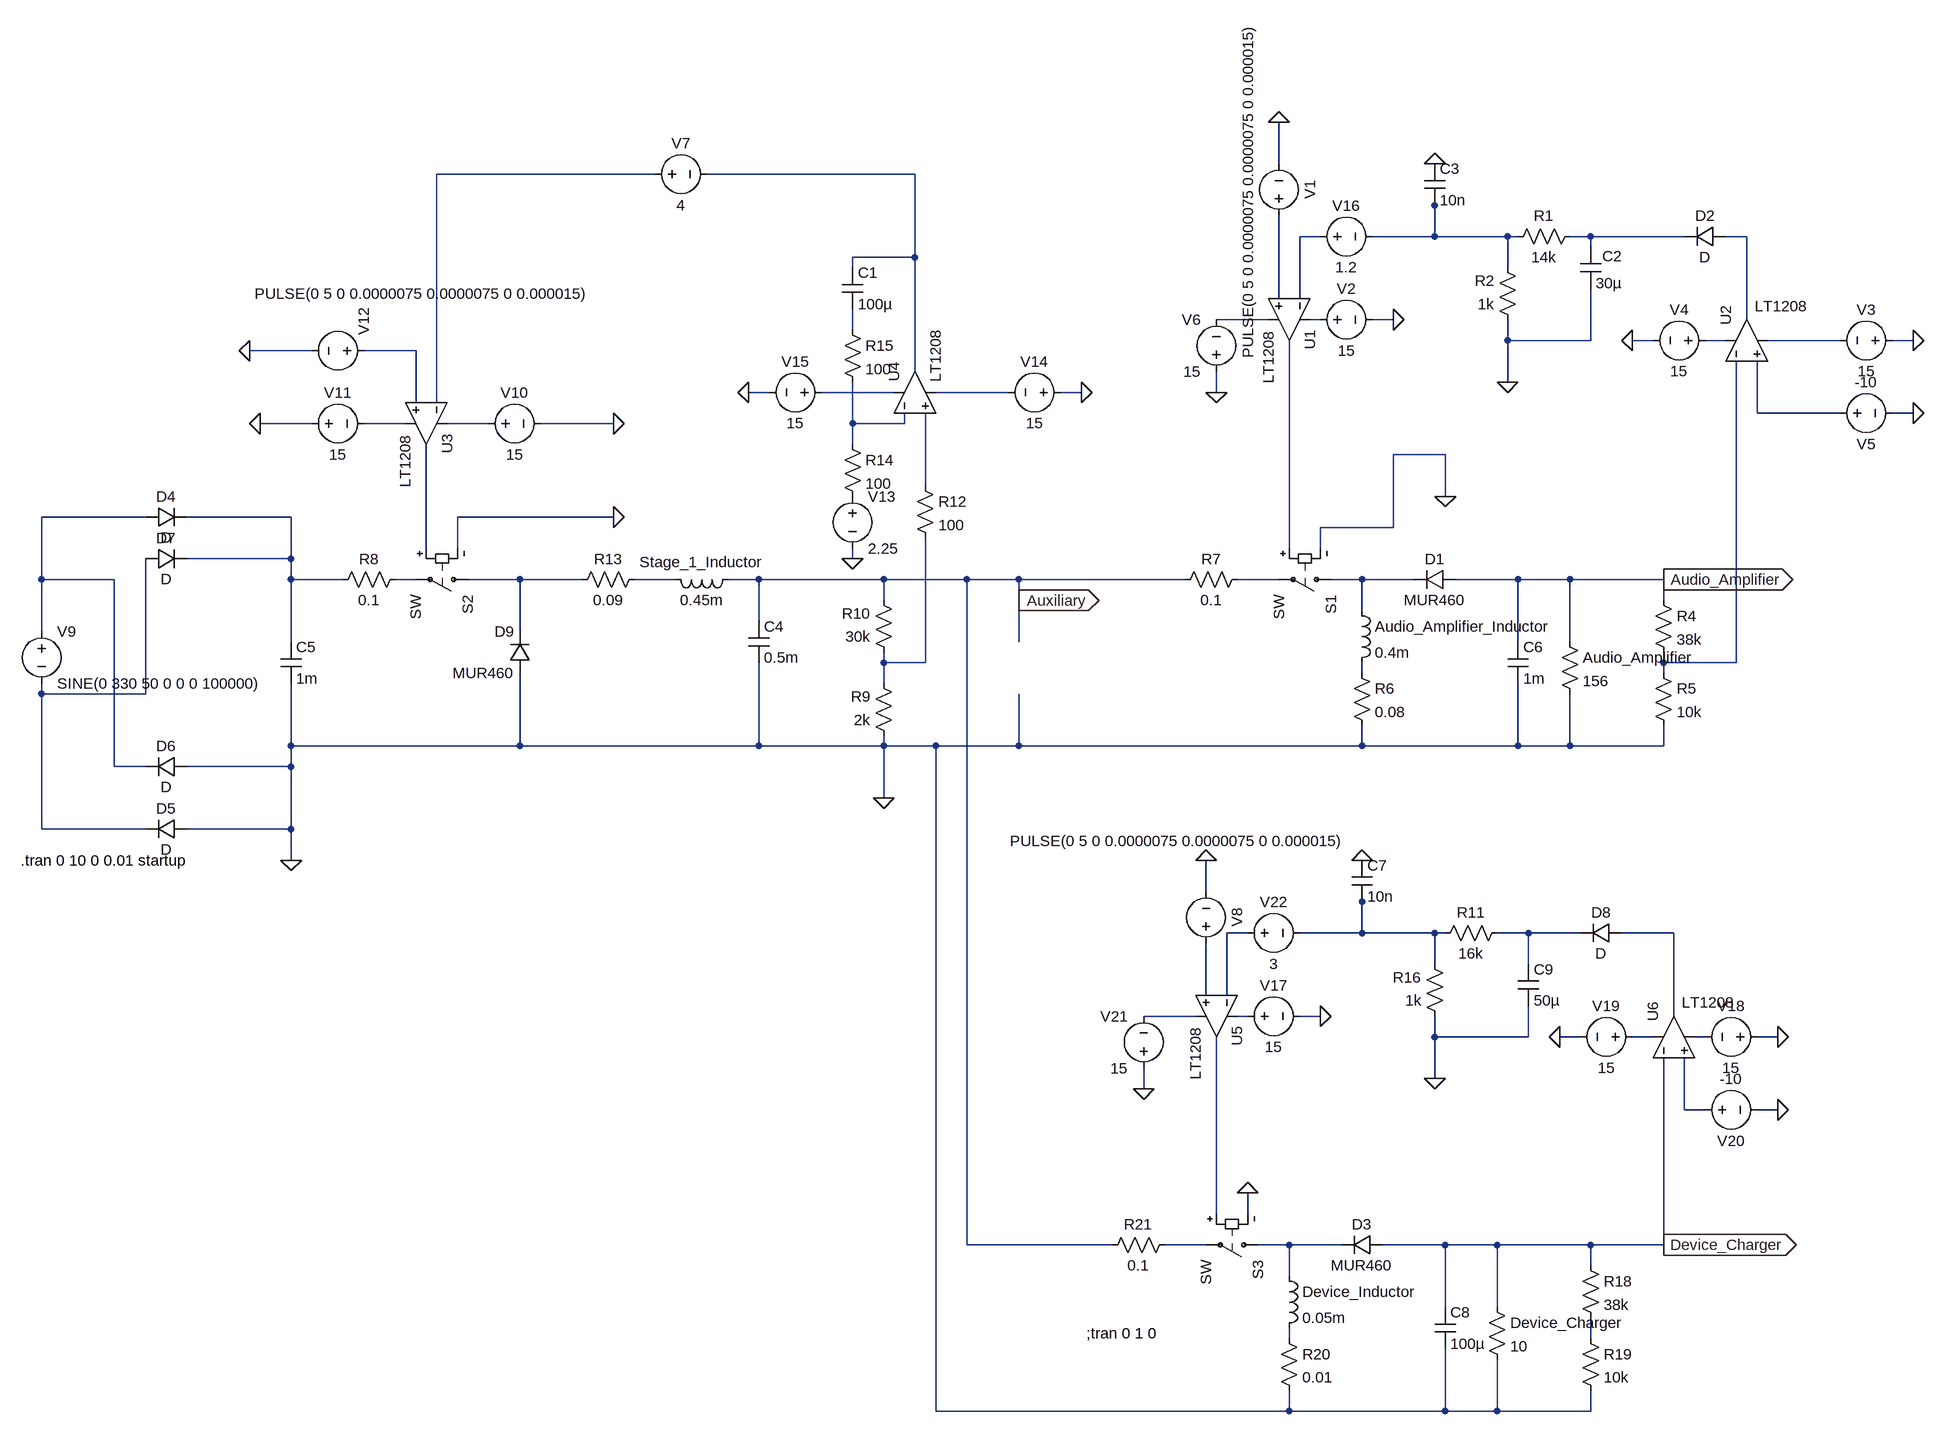
[diagram p0: schematic power_supply.asc]
power_supply.asc, the LTspice schematic file:
Version 4
SHEET 1 2580 1784
WIRE -256 -144 -256 -208
WIRE -1216 -128 -1552 -128
WIRE -816 -128 -1136 -128
WIRE -16 -80 -16 -96
WIRE -192 -32 -224 -32
WIRE -16 -32 -16 -80
WIRE -16 -32 -112 -32
WIRE 96 -32 -16 -32
WIRE 112 -32 96 -32
WIRE 224 -32 192 -32
WIRE 368 -32 224 -32
WIRE 464 -32 432 -32
WIRE 224 -16 224 -32
WIRE -816 0 -816 -128
WIRE -816 0 -912 0
WIRE -912 16 -912 0
WIRE 96 16 96 -32
WIRE -256 64 -256 -64
WIRE -224 64 -224 -32
WIRE -272 96 -352 96
WIRE -192 96 -208 96
WIRE -80 96 -112 96
WIRE 464 96 464 -32
WIRE -912 112 -912 80
WIRE 96 128 96 96
WIRE 224 128 224 48
WIRE 224 128 96 128
WIRE 320 128 288 128
WIRE 432 128 400 128
WIRE 608 128 496 128
WIRE 720 128 688 128
WIRE -1744 144 -1840 144
WIRE -1584 144 -1664 144
WIRE -816 176 -816 0
WIRE 96 192 96 128
WIRE -1040 208 -1072 208
WIRE -848 208 -960 208
WIRE -672 208 -784 208
WIRE -560 208 -592 208
WIRE -352 208 -352 176
WIRE -1584 224 -1584 144
WIRE -1552 224 -1552 -128
WIRE 480 240 480 160
WIRE 608 240 480 240
WIRE 720 240 688 240
WIRE -1744 256 -1824 256
WIRE -1600 256 -1664 256
WIRE -1472 256 -1536 256
WIRE -1280 256 -1392 256
WIRE -912 256 -912 192
WIRE -832 256 -832 240
WIRE -832 256 -912 256
WIRE -912 288 -912 256
WIRE 0 304 -80 304
WIRE -800 352 -800 240
WIRE 0 368 0 304
WIRE -2000 400 -2160 400
WIRE -1776 400 -1936 400
WIRE -1280 400 -1520 400
WIRE -80 416 -80 304
WIRE -80 416 -192 416
WIRE -1568 448 -1568 288
WIRE -1520 448 -1520 400
WIRE -240 448 -240 128
WIRE -192 448 -192 416
WIRE -1776 464 -1776 400
WIRE -1776 464 -1936 464
WIRE -912 464 -912 448
WIRE -2160 496 -2160 400
WIRE -2048 496 -2160 496
WIRE -1776 496 -1776 464
WIRE -1696 496 -1776 496
WIRE -1584 496 -1616 496
WIRE -1424 496 -1504 496
WIRE -1328 496 -1424 496
WIRE -1184 496 -1248 496
WIRE -1056 496 -1104 496
WIRE -864 496 -1056 496
WIRE -736 496 -864 496
WIRE -656 496 -736 496
WIRE -400 496 -656 496
WIRE -256 496 -320 496
WIRE -128 496 -176 496
WIRE -48 496 -128 496
WIRE 112 496 16 496
WIRE 192 496 112 496
WIRE 336 496 192 496
WIRE -864 528 -864 496
WIRE -656 528 -656 496
WIRE 336 528 336 496
WIRE -128 544 -128 496
WIRE -1056 560 -1056 496
WIRE -2160 576 -2160 496
WIRE -1424 576 -1424 496
WIRE -1776 592 -1776 496
WIRE -656 592 -656 528
WIRE 112 592 112 496
WIRE 192 592 192 496
WIRE -864 624 -864 608
WIRE -800 624 -800 432
WIRE -800 624 -864 624
WIRE 336 624 336 608
WIRE 448 624 448 160
WIRE 448 624 336 624
WIRE -128 640 -128 624
WIRE 336 640 336 624
WIRE -864 656 -864 624
WIRE -2160 672 -2160 656
WIRE -2000 672 -2000 464
WIRE -2000 672 -2160 672
WIRE -1776 752 -1776 656
WIRE -1424 752 -1424 640
WIRE -1424 752 -1776 752
WIRE -1056 752 -1056 624
WIRE -1056 752 -1424 752
WIRE -864 752 -864 736
WIRE -864 752 -1056 752
WIRE -784 752 -864 752
WIRE -656 752 -656 672
WIRE -656 752 -784 752
WIRE -128 752 -128 720
WIRE -128 752 -656 752
WIRE 112 752 112 656
WIRE 112 752 -128 752
WIRE 192 752 192 672
WIRE 192 752 112 752
WIRE 336 752 336 720
WIRE 336 752 192 752
WIRE -2048 784 -2048 496
WIRE -2000 784 -2048 784
WIRE -1776 784 -1776 752
WIRE -1776 784 -1936 784
WIRE -864 832 -864 752
WIRE -2160 880 -2160 672
WIRE -2000 880 -2160 880
WIRE -1776 880 -1776 784
WIRE -1776 880 -1936 880
WIRE -1776 928 -1776 880
WIRE -368 976 -368 928
WIRE -128 992 -128 976
WIRE -304 1040 -336 1040
WIRE -128 1040 -128 992
WIRE -128 1040 -224 1040
WIRE -16 1040 -128 1040
WIRE 0 1040 -16 1040
WIRE 128 1040 80 1040
WIRE 208 1040 128 1040
WIRE 352 1040 272 1040
WIRE -16 1088 -16 1040
WIRE 128 1088 128 1040
WIRE -368 1136 -368 1056
WIRE -336 1136 -336 1040
WIRE -384 1168 -464 1168
WIRE -304 1168 -320 1168
WIRE -192 1168 -224 1168
WIRE 352 1168 352 1040
WIRE -16 1200 -16 1168
WIRE 128 1200 128 1152
WIRE 128 1200 -16 1200
WIRE 208 1200 176 1200
WIRE 320 1200 288 1200
WIRE 400 1200 384 1200
WIRE 512 1200 480 1200
WIRE -16 1264 -16 1200
WIRE -464 1280 -464 1248
WIRE 368 1312 368 1232
WIRE 400 1312 368 1312
WIRE 512 1312 480 1312
WIRE -352 1472 -352 1200
WIRE -304 1472 -304 1440
WIRE -736 1520 -736 496
WIRE -512 1520 -736 1520
WIRE -368 1520 -432 1520
WIRE -240 1520 -288 1520
WIRE -160 1520 -240 1520
WIRE 0 1520 -96 1520
WIRE 80 1520 0 1520
WIRE 224 1520 80 1520
WIRE 336 1520 336 1232
WIRE 336 1520 224 1520
WIRE 224 1552 224 1520
WIRE -240 1568 -240 1520
WIRE 0 1616 0 1520
WIRE 80 1616 80 1520
WIRE -240 1664 -240 1648
WIRE 224 1664 224 1632
WIRE -784 1776 -784 752
WIRE -240 1776 -240 1744
WIRE -240 1776 -784 1776
WIRE 0 1776 0 1680
WIRE 0 1776 -240 1776
WIRE 80 1776 80 1696
WIRE 80 1776 0 1776
WIRE 224 1776 224 1744
WIRE 224 1776 80 1776
FLAG -1776 928 0
FLAG -1280 400 0
FLAG -1824 256 0
FLAG -1280 256 0
FLAG -560 208 0
FLAG -1840 144 0
FLAG -864 832 0
FLAG -1072 208 0
FLAG -912 464 0
FLAG -80 96 0
FLAG 720 128 0
FLAG 288 128 0
FLAG 720 240 0
FLAG -352 208 0
FLAG 96 192 0
FLAG 0 368 0
FLAG -16 -144 0
FLAG -256 -208 0
FLAG -192 1168 0
FLAG 512 1200 0
FLAG 176 1200 0
FLAG 512 1312 0
FLAG -464 1280 0
FLAG -16 1264 0
FLAG -304 1440 0
FLAG -128 928 0
FLAG -368 928 0
FLAG 336 1520 Device_Charger
IOPIN 336 1520 Out
FLAG 336 496 Audio_Amplifier
IOPIN 336 496 Out
FLAG -656 528 Auxiliary
IOPIN -656 528 Out
SYMBOL voltage -2160 560 R0
WINDOW 123 0 0 Left 2
WINDOW 39 0 0 Left 2
SYMATTR InstName V9
SYMATTR Value SINE(0 330 50 0 0 0 100000)
SYMBOL diode -2000 416 R270
WINDOW 0 32 32 VTop 2
WINDOW 3 0 32 VBottom 2
SYMATTR InstName D4
SYMBOL diode -1936 864 R90
WINDOW 0 0 32 VBottom 2
WINDOW 3 32 32 VTop 2
SYMATTR InstName D5
SYMBOL diode -1936 768 R90
WINDOW 0 0 32 VBottom 2
WINDOW 3 32 32 VTop 2
SYMATTR InstName D6
SYMBOL diode -2000 480 R270
WINDOW 0 32 32 VTop 2
WINDOW 3 0 32 VBottom 2
SYMATTR InstName D7
SYMBOL ind -1088 480 R90
WINDOW 0 5 56 VBottom 2
WINDOW 3 32 56 VTop 2
SYMATTR InstName Stage_1_Inductor
SYMATTR Value 0.45m
SYMBOL sw -1488 496 R90
SYMATTR InstName S2
SYMATTR SpiceModel MYSW
SYMBOL res -1600 480 R90
WINDOW 0 0 56 VBottom 2
WINDOW 3 32 56 VTop 2
SYMATTR InstName R8
SYMATTR Value 0.1
SYMBOL cap -1072 560 R0
SYMATTR InstName C4
SYMATTR Value 0.5m
SYMBOL voltage -1488 256 R270
WINDOW 0 32 56 VTop 2
WINDOW 3 -32 56 VBottom 2
WINDOW 123 0 0 Left 2
WINDOW 39 0 0 Left 2
SYMATTR InstName V10
SYMATTR Value 15
SYMBOL voltage -1760 256 R270
WINDOW 0 32 56 VTop 2
WINDOW 3 -32 56 VBottom 2
WINDOW 123 0 0 Left 2
WINDOW 39 0 0 Left 2
SYMATTR InstName V11
SYMATTR Value 15
SYMBOL voltage -1648 144 M270
WINDOW 3 88 184 VLeft 2
WINDOW 123 0 0 Left 2
WINDOW 39 0 0 Left 2
SYMATTR Value PULSE(0 5 0 0.0000075 0.0000075 0 0.000015)
SYMATTR InstName V12
SYMBOL voltage -576 208 R90
WINDOW 0 -32 56 VBottom 2
WINDOW 3 32 56 VTop 2
WINDOW 123 0 0 Left 2
WINDOW 39 0 0 Left 2
SYMATTR InstName V14
SYMATTR Value 15
SYMBOL voltage -944 208 R90
WINDOW 0 -32 56 VBottom 2
WINDOW 3 32 56 VTop 2
WINDOW 123 0 0 Left 2
WINDOW 39 0 0 Left 2
SYMATTR InstName V15
SYMATTR Value 15
SYMBOL Opamps\\LT1208 -1504 256 R90
SYMATTR InstName U3
SYMBOL Opamps\\LT1208 -880 208 R270
SYMATTR InstName U4
SYMBOL cap -1792 592 R0
SYMATTR InstName C5
SYMATTR Value 1m
SYMBOL res -848 752 R180
WINDOW 0 36 76 Left 2
WINDOW 3 36 40 Left 2
SYMATTR InstName R9
SYMATTR Value 2k
SYMBOL res -848 624 R180
WINDOW 0 36 76 Left 2
WINDOW 3 36 40 Left 2
SYMATTR InstName R10
SYMATTR Value 30k
SYMBOL diode -1408 640 R180
WINDOW 0 24 64 Left 2
WINDOW 3 24 0 Left 2
SYMATTR InstName D9
SYMATTR Value MUR460
SYMBOL res -1232 480 R90
WINDOW 0 0 56 VBottom 2
WINDOW 3 32 56 VTop 2
SYMATTR InstName R13
SYMATTR Value 0.09
SYMBOL voltage -1232 -128 R270
WINDOW 0 32 56 VTop 2
WINDOW 3 -32 56 VBottom 2
WINDOW 123 0 0 Left 2
WINDOW 39 0 0 Left 2
SYMATTR InstName V7
SYMATTR Value 4
SYMBOL res -816 336 R0
SYMATTR InstName R12
SYMATTR Value 100
SYMBOL voltage -912 352 R0
WINDOW 123 0 0 Left 2
WINDOW 39 0 0 Left 2
SYMATTR InstName V13
SYMATTR Value 2.25
SYMBOL res -928 272 R0
SYMATTR InstName R14
SYMATTR Value 100
SYMBOL res -928 96 R0
SYMATTR InstName R15
SYMATTR Value 100
SYMBOL cap -928 16 R0
SYMATTR InstName C1
SYMATTR Value 100µ
SYMBOL voltage -256 -48 R180
WINDOW 0 -32 56 VBottom 2
WINDOW 3 32 56 VTop 2
WINDOW 123 0 0 Left 2
WINDOW 39 0 0 Left 2
SYMATTR InstName V1
SYMATTR Value PULSE(0 5 0 0.0000075 0.0000075 0 0.000015)
SYMBOL Opamps\\LT1208 -176 96 R90
SYMATTR InstName U1
SYMBOL voltage -208 96 R270
WINDOW 0 32 56 VTop 2
WINDOW 3 -32 56 VBottom 2
WINDOW 123 0 0 Left 2
WINDOW 39 0 0 Left 2
SYMATTR InstName V2
SYMATTR Value 15
SYMBOL Opamps\\LT1208 400 128 R270
WINDOW 3 53 76 VRight 2
WINDOW 0 23 32 Left 2
SYMATTR InstName U2
SYMBOL voltage 704 128 R90
WINDOW 0 -32 56 VBottom 2
WINDOW 3 32 56 VTop 2
WINDOW 123 0 0 Left 2
WINDOW 39 0 0 Left 2
SYMATTR InstName V3
SYMATTR Value 15
SYMBOL voltage 416 128 R90
WINDOW 0 -32 56 VBottom 2
WINDOW 3 32 56 VTop 2
WINDOW 123 0 0 Left 2
WINDOW 39 0 0 Left 2
SYMATTR InstName V4
SYMATTR Value 15
SYMBOL voltage 592 240 R270
WINDOW 0 -32 56 VBottom 2
WINDOW 3 32 56 VTop 2
WINDOW 123 0 0 Left 2
WINDOW 39 0 0 Left 2
SYMATTR InstName V5
SYMATTR Value -10
SYMBOL voltage -352 192 R180
WINDOW 0 24 96 Left 2
WINDOW 3 24 16 Left 2
WINDOW 123 0 0 Left 2
WINDOW 39 0 0 Left 2
SYMATTR InstName V6
SYMATTR Value 15
SYMBOL diode 16 480 R90
WINDOW 0 0 32 VBottom 2
WINDOW 3 32 32 VTop 2
SYMATTR InstName D1
SYMATTR Value MUR460
SYMBOL voltage -208 -32 R270
WINDOW 0 32 56 VTop 2
WINDOW 3 -32 56 VBottom 2
WINDOW 123 0 0 Left 2
WINDOW 39 0 0 Left 2
SYMATTR InstName V16
SYMATTR Value 1.2
SYMBOL res 208 -48 R90
WINDOW 0 0 56 VBottom 2
WINDOW 3 32 56 VTop 2
SYMATTR InstName R1
SYMATTR Value 14k
SYMBOL res 112 112 R180
WINDOW 0 36 76 Left 2
WINDOW 3 36 40 Left 2
SYMATTR InstName R2
SYMATTR Value 1k
SYMBOL diode 432 -48 R90
WINDOW 0 0 32 VBottom 2
WINDOW 3 32 32 VTop 2
SYMATTR InstName D2
SYMBOL cap 208 -16 R0
WINDOW 0 34 14 Left 2
SYMATTR InstName C2
SYMATTR Value 30µ
SYMBOL cap -32 -144 R0
SYMATTR InstName C3
SYMATTR Value 10n
SYMBOL ind -144 528 R0
SYMATTR InstName Audio_Amplifier_Inductor
SYMATTR Value 0.4m
SYMBOL cap 96 592 R0
SYMATTR InstName C6
SYMATTR Value 1m
SYMBOL res 176 576 R0
SYMATTR InstName Audio_Amplifier
SYMATTR Value 156
SYMBOL res 320 512 R0
SYMATTR InstName R4
SYMATTR Value 38k
SYMBOL res 320 624 R0
SYMATTR InstName R5
SYMATTR Value 10k
SYMBOL res -144 624 R0
SYMATTR InstName R6
SYMATTR Value 0.08
SYMBOL sw -160 496 R90
SYMATTR InstName S1
SYMBOL res -304 480 R90
WINDOW 0 0 56 VBottom 2
WINDOW 3 32 56 VTop 2
SYMATTR InstName R7
SYMATTR Value 0.1
SYMBOL voltage -368 1072 R180
WINDOW 0 -32 56 VBottom 2
WINDOW 3 42 158 Top 2
WINDOW 123 0 0 Left 2
WINDOW 39 0 0 Left 2
SYMATTR InstName V8
SYMATTR Value PULSE(0 5 0 0.0000075 0.0000075 0 0.000015)
SYMBOL Opamps\\LT1208 -288 1168 R90
SYMATTR InstName U5
SYMBOL voltage -320 1168 R270
WINDOW 0 32 56 VTop 2
WINDOW 3 -32 56 VBottom 2
WINDOW 123 0 0 Left 2
WINDOW 39 0 0 Left 2
SYMATTR InstName V17
SYMATTR Value 15
SYMBOL Opamps\\LT1208 288 1200 R270
WINDOW 3 53 76 VRight 2
WINDOW 0 23 32 Left 2
SYMATTR InstName U6
SYMBOL voltage 496 1200 R90
WINDOW 0 -32 56 VBottom 2
WINDOW 3 32 56 VTop 2
WINDOW 123 0 0 Left 2
WINDOW 39 0 0 Left 2
SYMATTR InstName V18
SYMATTR Value 15
SYMBOL voltage 304 1200 R90
WINDOW 0 -32 56 VBottom 2
WINDOW 3 32 56 VTop 2
WINDOW 123 0 0 Left 2
WINDOW 39 0 0 Left 2
SYMATTR InstName V19
SYMATTR Value 15
SYMBOL voltage 384 1312 R270
WINDOW 0 -32 56 VBottom 2
WINDOW 3 32 56 VTop 2
WINDOW 123 0 0 Left 2
WINDOW 39 0 0 Left 2
SYMATTR InstName V20
SYMATTR Value -10
SYMBOL voltage -464 1264 R180
WINDOW 0 24 96 Left 2
WINDOW 3 24 16 Left 2
WINDOW 123 0 0 Left 2
WINDOW 39 0 0 Left 2
SYMATTR InstName V21
SYMATTR Value 15
SYMBOL diode -96 1504 R90
WINDOW 0 0 32 VBottom 2
WINDOW 3 32 32 VTop 2
SYMATTR InstName D3
SYMATTR Value MUR460
SYMBOL voltage -320 1040 R270
WINDOW 0 32 56 VTop 2
WINDOW 3 -32 56 VBottom 2
WINDOW 123 0 0 Left 2
WINDOW 39 0 0 Left 2
SYMATTR InstName V22
SYMATTR Value 3
SYMBOL res 96 1024 R90
WINDOW 0 0 56 VBottom 2
WINDOW 3 32 56 VTop 2
SYMATTR InstName R11
SYMATTR Value 16k
SYMBOL res 0 1184 R180
WINDOW 0 36 76 Left 2
WINDOW 3 36 40 Left 2
SYMATTR InstName R16
SYMATTR Value 1k
SYMBOL diode 272 1024 R90
WINDOW 0 0 32 VBottom 2
WINDOW 3 32 32 VTop 2
SYMATTR InstName D8
SYMBOL cap -144 928 R0
SYMATTR InstName C7
SYMATTR Value 10n
SYMBOL ind -256 1552 R0
SYMATTR InstName Device_Inductor
SYMATTR Value 0.05m
SYMBOL cap -16 1616 R0
SYMATTR InstName C8
SYMATTR Value 100µ
SYMBOL res 64 1600 R0
SYMATTR InstName Device_Charger
SYMATTR Value 10
SYMBOL res 208 1536 R0
SYMATTR InstName R18
SYMATTR Value 38k
SYMBOL res 208 1648 R0
SYMATTR InstName R19
SYMATTR Value 10k
SYMBOL res -256 1648 R0
SYMATTR InstName R20
SYMATTR Value 0.01
SYMBOL sw -272 1520 R90
SYMATTR InstName S3
SYMBOL res -416 1504 R90
WINDOW 0 0 56 VBottom 2
WINDOW 3 32 56 VTop 2
SYMATTR InstName R21
SYMATTR Value 0.1
SYMBOL cap 112 1088 R0
SYMATTR InstName C9
SYMATTR Value 50µ
TEXT -2192 928 Left 2 !.tran 0 10 0 0.01 startup
TEXT -552 1656 Left 2 !;tran 0 1 0

The netlist it stands for:
* power_supply.asc
V9 N021 N033 SINE(0 330 50 0 0 0 100000)
D4 N021 N022 D
D5 0 N033 D
D6 0 N021 D
D7 N033 N022 D
L§Stage_1_Inductor Auxiliary N027 0.45m
S2 N026 N025 N023 0 MYSW SW
R8 N025 N022 0.1
C4 Auxiliary 0 0.5m
V10 N018 0 15
V11 0 N017 15
V12 N013 0 PULSE(0 5 0 0.0000075 0.0000075 0 0.000015)
V14 0 N015 15
V15 N014 0 15
XU3 N013 N001 N018 N017 N023 LT1208  ; pins In+ In- V+ V- OUT
XU4 N020 N019 N014 N015 N002 LT1208  ; pins In+ In- V+ V- OUT
C5 N022 0 1m
R9 0 N030 2k
R10 N030 Auxiliary 30k
D9 0 N026 MUR460
R13 N027 N026 0.09
V7 N001 N002 4
R12 N020 N030 100
V13 P001 0 2.25
R14 N019 P001 100
R15 N010 N019 100
C1 N002 N010 100µ
V1 N007 0 PULSE(0 5 0 0.0000075 0.0000075 0 0.000015)
XU1 N007 N004 N009 N008 N024 LT1208  ; pins In+ In- V+ V- OUT
V2 N009 0 15
XU2 N016 N031 N011 N012 N006 LT1208  ; pins In+ In- V+ V- OUT
V3 0 N012 15
V4 N011 0 15
V5 N016 0 -10
V6 0 N008 15
D1 Audio_Amplifier N029 MUR460
V16 N004 N003 1.2
R1 N005 N003 14k
R2 0 N003 1k
D2 N006 N005 D
C2 N005 0 30µ
C3 0 N003 10n
L§Audio_Amplifier_Inductor N029 N032 0.4m
C6 Audio_Amplifier 0 1m
R§Audio_Amplifier Audio_Amplifier 0 156
R4 Audio_Amplifier N031 38k
R5 N031 0 10k
R6 N032 0 0.08
S1 N029 N028 N024 0 SW
R7 N028 Auxiliary 0.1
V8 N038 0 PULSE(0 5 0 0.0000075 0.0000075 0 0.000015)
XU5 N038 N035 N040 N039 N044 LT1208  ; pins In+ In- V+ V- OUT
V17 N040 0 15
XU6 N043 Device_Charger N041 N042 N037 LT1208  ; pins In+ In- V+ V- OUT
V18 0 N042 15
V19 N041 0 15
V20 N043 0 -10
V21 0 N039 15
D3 Device_Charger N046 MUR460
V22 N035 N034 3
R11 N036 N034 16k
R16 0 N034 1k
D8 N037 N036 D
C7 0 N034 10n
L§Device_Inductor N046 N047 0.05m
C8 Device_Charger 0 100µ
R§Device_Charger Device_Charger 0 10
R18 Device_Charger N048 38k
R19 N048 0 10k
R20 N047 0 0.01
S3 N046 N045 N044 0 SW
R21 N045 Auxiliary 0.1
C9 N036 0 50µ
.model D D
.lib standard.dio
.tran 0 10 0 0.01 startup
;tran 0 1 0
.backanno
.end